# Altium schematic sheet SolarSenseBoard.SchDoc: Solar Sense Slave
size Letter; SheetNumber: 3; SheetTotal: 4; Website: www.uwmidsun.com
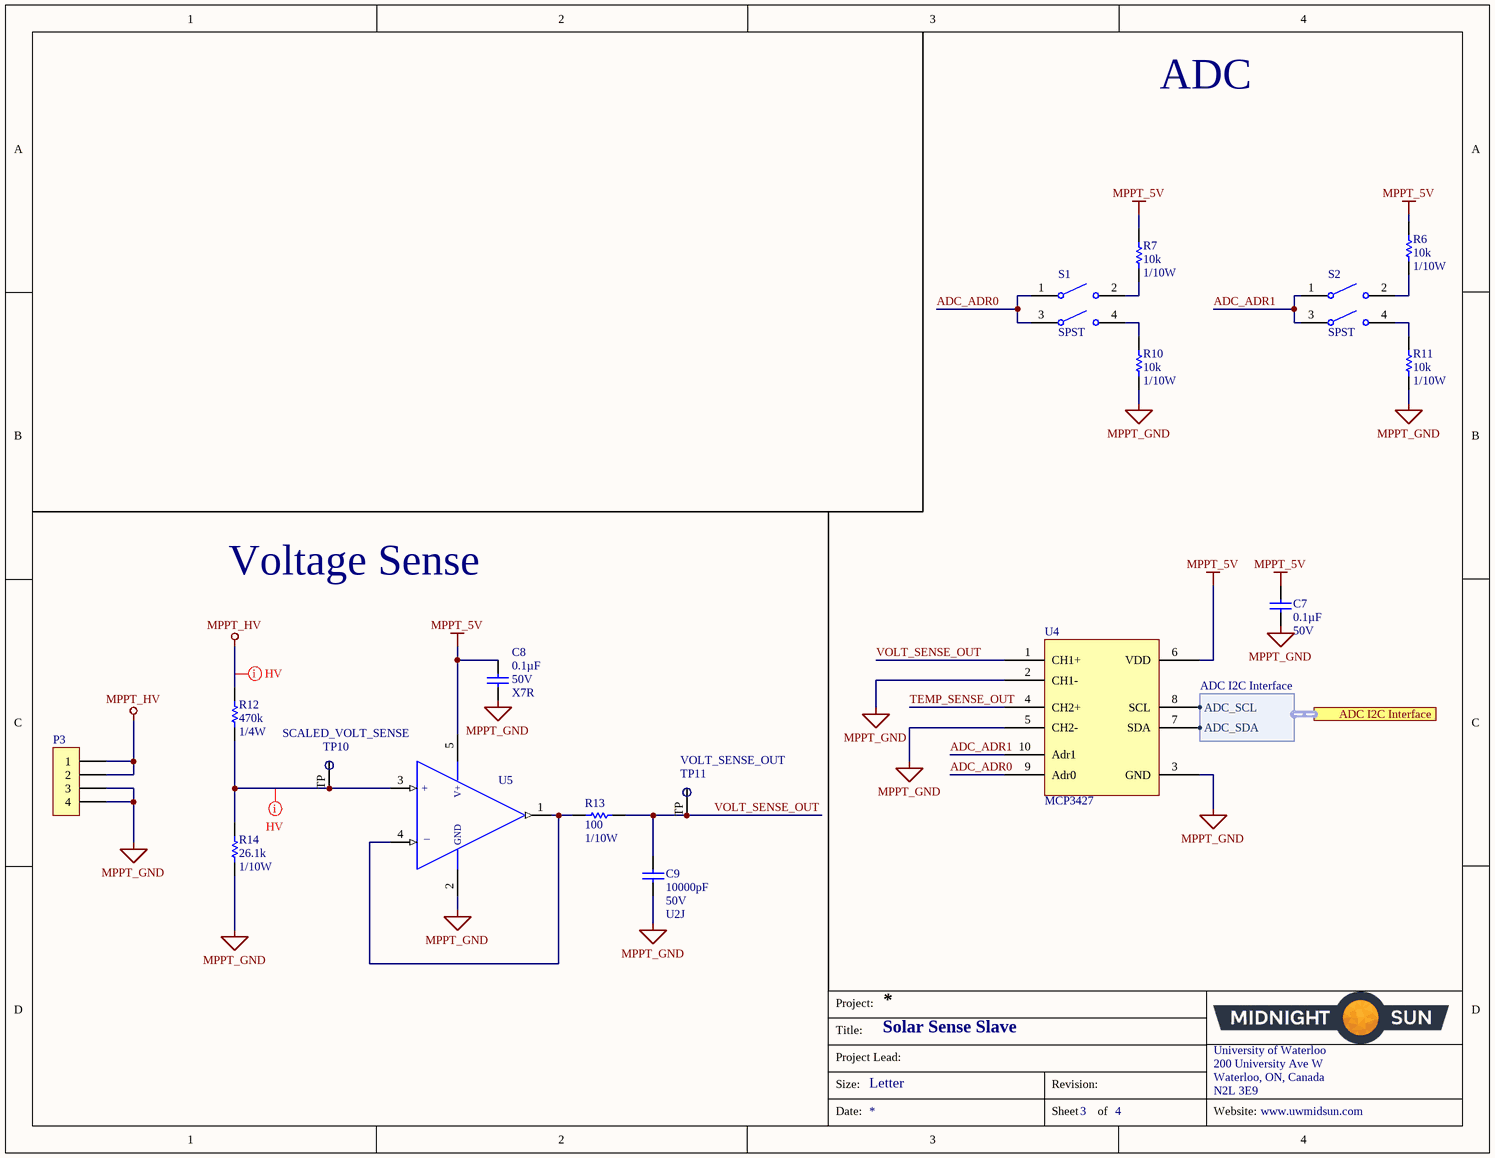
[diagram p0: SolarSenseBoard.SchDoc]

## Parts
C7  Capacitance: 0.1µF  Voltage: 50V  [CAP, 0603]  (hidden comment: CAP CER 0.1UF 50V 10% X7R 0603)
C8  Capacitance: 0.1µF  Voltage: 50V  Temperature Coefficient: X7R  [CAP, 0603]  (hidden comment: CAP CER 0.1UF 50V 10% X7R 0603)
C9  Capacitance: 10000pF  Voltage: 50V  Temperature Coefficient: U2J  [CAP, 0603]  (hidden comment: CAP CER 10nF 50V 5% X7R 0603)
P3  CONN 4POS MX150L  [CONN, 4POS MX150L]  (value not drawn)
R6  Resistance: 10k  Power: 1/10W  [RES, 0603]  (hidden comment: RES 10K OHM 1% 1/10W 0603)
R7  Resistance: 10k  Power: 1/10W  [RES, 0603]  (hidden comment: RES 10K OHM 1% 1/10W 0603)
R10  Resistance: 10k  Power: 1/10W  [RES, 0603]  (hidden comment: RES 10K OHM 1% 1/10W 0603)
R11  Resistance: 10k  Power: 1/10W  [RES, 0603]  (hidden comment: RES 10K OHM 1% 1/10W 0603)
R12  Resistance: 470k  Power: 1/4W  [RES, 0603]  (hidden comment: RES 470K OHM 1% 1/4W 0603)
R13  Resistance: 100  Power: 1/10W  [RES, 0603]  (hidden comment: RES 100 OHM 1% 1/10W 0603)
R14  Resistance: 26.1k  Power: 1/10W  [RES, 0603]  (hidden comment: RES 26.1K OHM 1% 1/10W 0603)
S1  SPST  [SW SPST 2POS DIP 0.1A 20V]
S2  SPST  [SW SPST 2POS DIP 0.1A 20V]
TP10  SCALED_VOLT_SENSE  [Test Point]  (no BOM)
TP11  VOLT_SENSE_OUT  [Test Point]
U4  Base Part Number: MCP3427  [IC ADC MCP3427]  (hidden comment: IC ADC MCP3427 10MSOP)
U5  IC OP AMP GEN PURPOSE RR 10MHZ SOT-23-5  [IC OP AMP GP RR 10MHZ SOT-23-5]  (value not drawn)

## Ports
ADC I2C Interface (harness ADC I2C Interface)

## Harnesses
ADC I2C Interface: ADC_SCL, ADC_SDA

## Nets
MPPT_5V: C7.1 C8.1 R6.1 R7.1 U4.6(VDD) U5.5(VDD)
MPPT_GND: C7.2 C8.2 C9.2 P3.3 P3.4 R10.2 R11.2 R14.2 U4.2(CH1-) U4.3(GND) U4.5(CH2-) U5.2(VSS)
MPPT_HV: P3.1 P3.2 R12.1
ADC_ADR0: S1.1 S1.3 U4.9(Adr0)
ADC_ADR1: S2.1 S2.3 U4.10(Adr1)
TEMP_SENSE_OUT: U4.4(CH2+)
VOLT_SENSE_OUT: C9.1 R13.2 TP11.TP U4.1(CH1+)
NetR6_2: R6.2 S2.2
NetR7_2: R7.2 S1.2
NetR10_1: R10.1 S1.4
NetR11_1: R11.1 S2.4
NetR12_2: R12.2 R14.1 TP10.TP U5.3(+IN)
NetR13_1: R13.1 U5.1(OUTPUT) U5.4(-IN)
NetU4_7: U4.7(SDA) ; port ADC I2C Interface.ADC_SDA
NetU4_8: U4.8(SCL) ; port ADC I2C Interface.ADC_SCL

## Layout directives
net class HV: MPPT_HV, NetR12_2

## Notes on the sheet
- ADC
- Voltage Sense
- Project:
- Title:
- Size:
- Project Lead:
- Letter
- Revision:
- University of Waterloo
- 200 University Ave W
- Waterloo, ON, Canada
- N2L 3E9
- Date:
- Sheet
- of
- Website:
- (in symbol IC OP AMP GEN PURPOSE RR 10MHZ SOT-23-5) V+; +; GND; _

## Library data of the parts
C7 C8 = CAP CER 0.1UF 50V 10% X7R 0603: 0.10µF ±10% 50V Ceramic Capacitor X7R 0603 (1608 Metric); Manufacturer 1: AVX Corporation; Manufacturer Part Number 1: 06035C104KAT2A; Supplier 1: Digi-Key; Supplier Part Number 1: 478-5052-1-ND; Packaging: Cut Tape (CT); Part Status: Active; Operating Temperature: -55°C ~ 125°C; Ratings: -; Mounting Type: Surface Mount, MLCC; Package / Case: 0603 (1608 Metric); Size / Dimension: 0.063" L x 0.032" W (1.60mm x 0.81mm); Height - Seated (Max): -; Thickness (Max): 0.035" (0.90mm); Lead Spacing: -; Lead Style: -; ComponentLink1URL: http://datasheets.avx.com/X7RDielectric.pdf; ComponentLink1Description: http://datasheets.avx.com/X7RDielectric.pdf; Tolerance: ±10%
  C7: Temperature Coefficient: X7R
C9 = CAP CER 10nF 50V 5% X7R 0603: 10000pF ±5% 50V Ceramic Capacitor U2J 0603 (1608 Metric); Manufacturer 1: KEMET; Manufacturer Part Number 1: C0603C103J5JAC7867; Supplier 1: Digi-Key; Supplier Part Number 1: 399-13384-1-ND; Packaging: Cut Tape (CT); Part Status: Active; Operating Temperature: -55°C ~ 125°C; Ratings: -; Failure Rate: -; Mounting Type: Surface Mount, MLCC; Package / Case: 0603 (1608 Metric); Size / Dimension: 0.063" L x 0.032" W (1.60mm x 0.80mm); Height - Seated (Max): -; Thickness (Max): 0.034" (0.87mm); Lead Spacing: -; Lead Style: -; ComponentLink1URL: http://www.kemet.com/docfinder?Partnumber=C0603C103J5JAC7867; ComponentLink1Description: http://www.kemet.com/docfinder?Partnumber=C0603C103J5JAC7867; Tolerance: ±5%
P3 = CONN 4POS MX150L: Connector Header Panel Mount, Through Hole, Right Angle 4 position 0.230" (5.84mm)
R6 R7 R10 R11 = RES 10K OHM 1% 1/10W 0603: RES SMD 10K OHM 1% 1/10W 0603; Manufacturer 1: Yageo; Manufacturer Part Number 1: RC0603FR-0710KL; Temperature Coefficient: ±100ppm/°C; Supplier 1: Digi-Key; Supplier Part Number 1: 311-10.0KHRCT-ND; Packaging: Cut Tape (CT); Part Status: Active; Composition: Thick Film; Operating Temperature: -55°C ~ 155°C; Package / Case: 0603 (1608 Metric); Supplier Device Package: 0603; Size / Dimension: 0.063" L x 0.031" W (1.60mm x 0.80mm); Height - Seated (Max): 0.022" (0.55mm); Failure Rate: -; ComponentLink1URL: http://www.yageo.com/documents/recent/PYu-RC_Group_51_RoHS_L_7.pdf; ComponentLink1Description: http://www.yageo.com/documents/recent/PYu-RC_Group_51_RoHS_L_7.pdf; Tolerance: ±1%
R12 = RES 470K OHM 1% 1/4W 0603: RES SMD 470K OHM 1% 1/4W 0603; Manufacturer 1: Panasonic Electronic Components; Manufacturer Part Number 1: ERJ-PA3F4703V; Temperature Coefficient: ±100ppm/°C; Supplier 1: Digi-Key; Supplier Part Number 1: P470KBYCT-ND; Packaging: Cut Tape (CT); Part Status: Active; Composition: Thick Film; Operating Temperature: -55°C ~ 155°C; Package / Case: 0603 (1608 Metric); Supplier Device Package: 0603; Size / Dimension: 0.063" L x 0.031" W (1.60mm x 0.80mm); Height - Seated (Max): 0.022" (0.55mm); Failure Rate: -; ComponentLink1URL: https://industrial.panasonic.com/cdbs/www-data/pdf/RDO0000/AOA0000C291.pdf; ComponentLink1Description: https://industrial.panasonic.com/cdbs/www-data/pdf/RDO0000/AOA0000C291.pdf; Tolerance: ±1%
R13 = RES 100 OHM 1% 1/10W 0603: 100 Ohm ±1% 0.1W, 1/10W Chip Resistor 0603 (1608 Metric) Moisture Resistant Thick Film; Manufacturer 1: Yageo; Manufacturer Part Number 1: RC0603FR-07100RL; Temperature Coefficient: ±100ppm/°C; Supplier 1: Digi-Key; Supplier Part Number 1: 311-100HRCT-ND; Packaging: Cut Tape (CT); Part Status: Active; Composition: Thick Film; Operating Temperature: -55°C ~ 155°C; Package / Case: 0603 (1608 Metric); Supplier Device Package: 0603; Size / Dimension: 0.063" L x 0.031" W (1.60mm x 0.80mm); Height - Seated (Max): 0.022" (0.55mm); Failure Rate: -; ComponentLink1URL: http://www.yageo.com/documents/recent/PYu-RC_Group_51_RoHS_L_7.pdf; ComponentLink1Description: http://www.yageo.com/documents/recent/PYu-RC_Group_51_RoHS_L_7.pdf; Tolerance: ±1%
R14 = RES 26.1K OHM 1% 1/10W 0603: RES SMD 26.1K OHM 1% 1/10W 0603; Manufacturer 1: Yageo; Manufacturer Part Number 1: RC0603FR-0726K1L; Temperature Coefficient: ±100ppm/°C; Supplier 1: Digi-Key; Supplier Part Number 1: 311-26.1KHRCT-ND; Packaging: Cut Tape (CT); Part Status: Active; Composition: Thick Film; Operating Temperature: -55°C ~ 155°C; Package / Case: 0603 (1608 Metric); Supplier Device Package: 0603; Size / Dimension: 0.063" L x 0.031" W (1.60mm x 0.80mm); Height - Seated (Max): 0.022" (0.55mm); Failure Rate: -; ComponentLink1URL: http://www.yageo.com/documents/recent/PYu-RC_Group_51_RoHS_L_7.pdf; ComponentLink1Description: http://www.yageo.com/documents/recent/PYu-RC_Group_51_RoHS_L_7.pdf; Tolerance: ±1%
S1 S2 = SW SPST 2POS DIP 0.1A 20V: SWITCH SLIDE DIP SPST 100MA 20V; Manufacturer: CTS Electrocomponents; Manufacturer Part Number: 219-2MST; Voltage Rating: 20VDC; Actuator Type: Slide (Standard); Actuator Level: Raised; Pitch: 0.100" (2.54mm), Full; Washable: Yes; Electrical Life: 2,000 Cycles; Supplier 1: Digi-Key; RoHS: RoHS Compliant; Category: Switches; Stock 1: 444; Pricing 1: 1=0.84, 10=0.818, 25=0.7708, 50=0.7234, 100=0.6921, 250=0.66056, 500=0.59762, 1000=0.55044, 5000=0.44822 (CAD); Packaging: Tube; Part Status: Active; Circuit: SPST; Current Rating: 100mA; Contact Material: Beryllium Copper; Contact Finish: Gold; Height Above Board: 0.170" (4.33mm); Mounting Type: Surface Mount; Termination Style: Gull Wing; Features: Epoxy Sealed Terminals, Tape Seal; Operating Temperature: -55°C ~ 85°C; Body Material: -; Length: 0.258" (6.55mm); Mechanical Life: -; ComponentLink1URL: https://www.ctscorp.com/wp-content/uploads/219.pdf; ComponentLink1Description: https://www.ctscorp.com/wp-content/uploads/219.pdf; Supplier Part Number 1: CT2192MST-ND
TP10 TP11 = Test Point
U4 = IC ADC MCP3427 10MSOP: 16 Bit Analog to Digital Converter 2 Input 1 Sigma-Delta 10-MSOP; Manufacturer: Microchip Technology; Manufacturer Part Number: MCP3427-E/UN; Number of Bits: 16; Sampling Rate (Per Second): 15; Number of Inputs: 2; Input Type: Differential; Data Interface: I²C; Configuration: MUX-PGA-ADC; Reference Type: Internal; Voltage - Supply, Analog: 2.7 V ~ 5.5 V; Supplier 1: Digi-Key; RoHS: RoHS Compliant; Category: Integrated Circuits (ICs); Stock 1: 3001; Pricing 1: 1=4.32, 25=3.6064, 100=3.2704 (CAD); Packaging: Tube; Part Status: Active; Ratio - S/H:ADC: -; Architecture: Sigma-Delta; Voltage - Supply, Digital: 2.7 V ~ 5.5 V; Features: PGA, Selectable Address; Operating Temperature: -40°C ~ 125°C; Package / Case: 10-TFSOP, 10-MSOP (0.118", 3.00mm Width); Supplier Device Package: 10-MSOP; ComponentLink1URL: http://www.microchip.com/mymicrochip/filehandler.aspx?ddocname=en546216; ComponentLink1Description: http://www.microchip.com/mymicrochip/filehandler.aspx?ddocname=en546216; Supplier Part Number 1: MCP3427-E/UN-ND
U5 = IC OP AMP GEN PURPOSE RR 10MHZ SOT-23-5: General Purpose Amplifier 1 Circuit Rail-to-Rail SOT-23-5; Manufacturer 1: Texas Instruments; Manufacturer Part Number 1: TLV316QDBVRQ1; Description 1: IC OP AMP GP RR 10MHZ 5-SOT-23; Number of Circuits: 1; Slew Rate: 6 V/µs; Current - Supply: 400µA; Current - Output / Channel: 50mA; Voltage - Supply, Single/Dual (±): 1.8 V ~ 5.5 V, ±0.9 V ~ 2.75 V; Supplier 1: Digi-Key; Supplier Part Number 1: 296-45323-1-ND; RoHS: RoHS Compliant; Category: Integrated Circuits (ICs); Stock 1: 1747; Pricing 1: 1=1.33, 10=1.185, 100=0.9234, 500=0.76276, 1000=0.60218 (CAD); Packaging: Cut Tape (CT); Part Status: Active; Amplifier Type: General Purpose; Output Type: Rail-to-Rail; -3db Bandwidth: -; Operating Temperature: -40°C ~ 125°C; Mounting Type: Surface Mount; Package / Case: SC-74A, SOT-753; Supplier Device Package: SOT-23-5; ComponentLink1URL: http://www.ti.com/lit/ds/symlink/tlv316-q1.pdf; ComponentLink1Description: http://www.ti.com/lit/ds/symlink/tlv316-q1.pdf